# Altium schematic sheet GPS.SchDoc
size A3
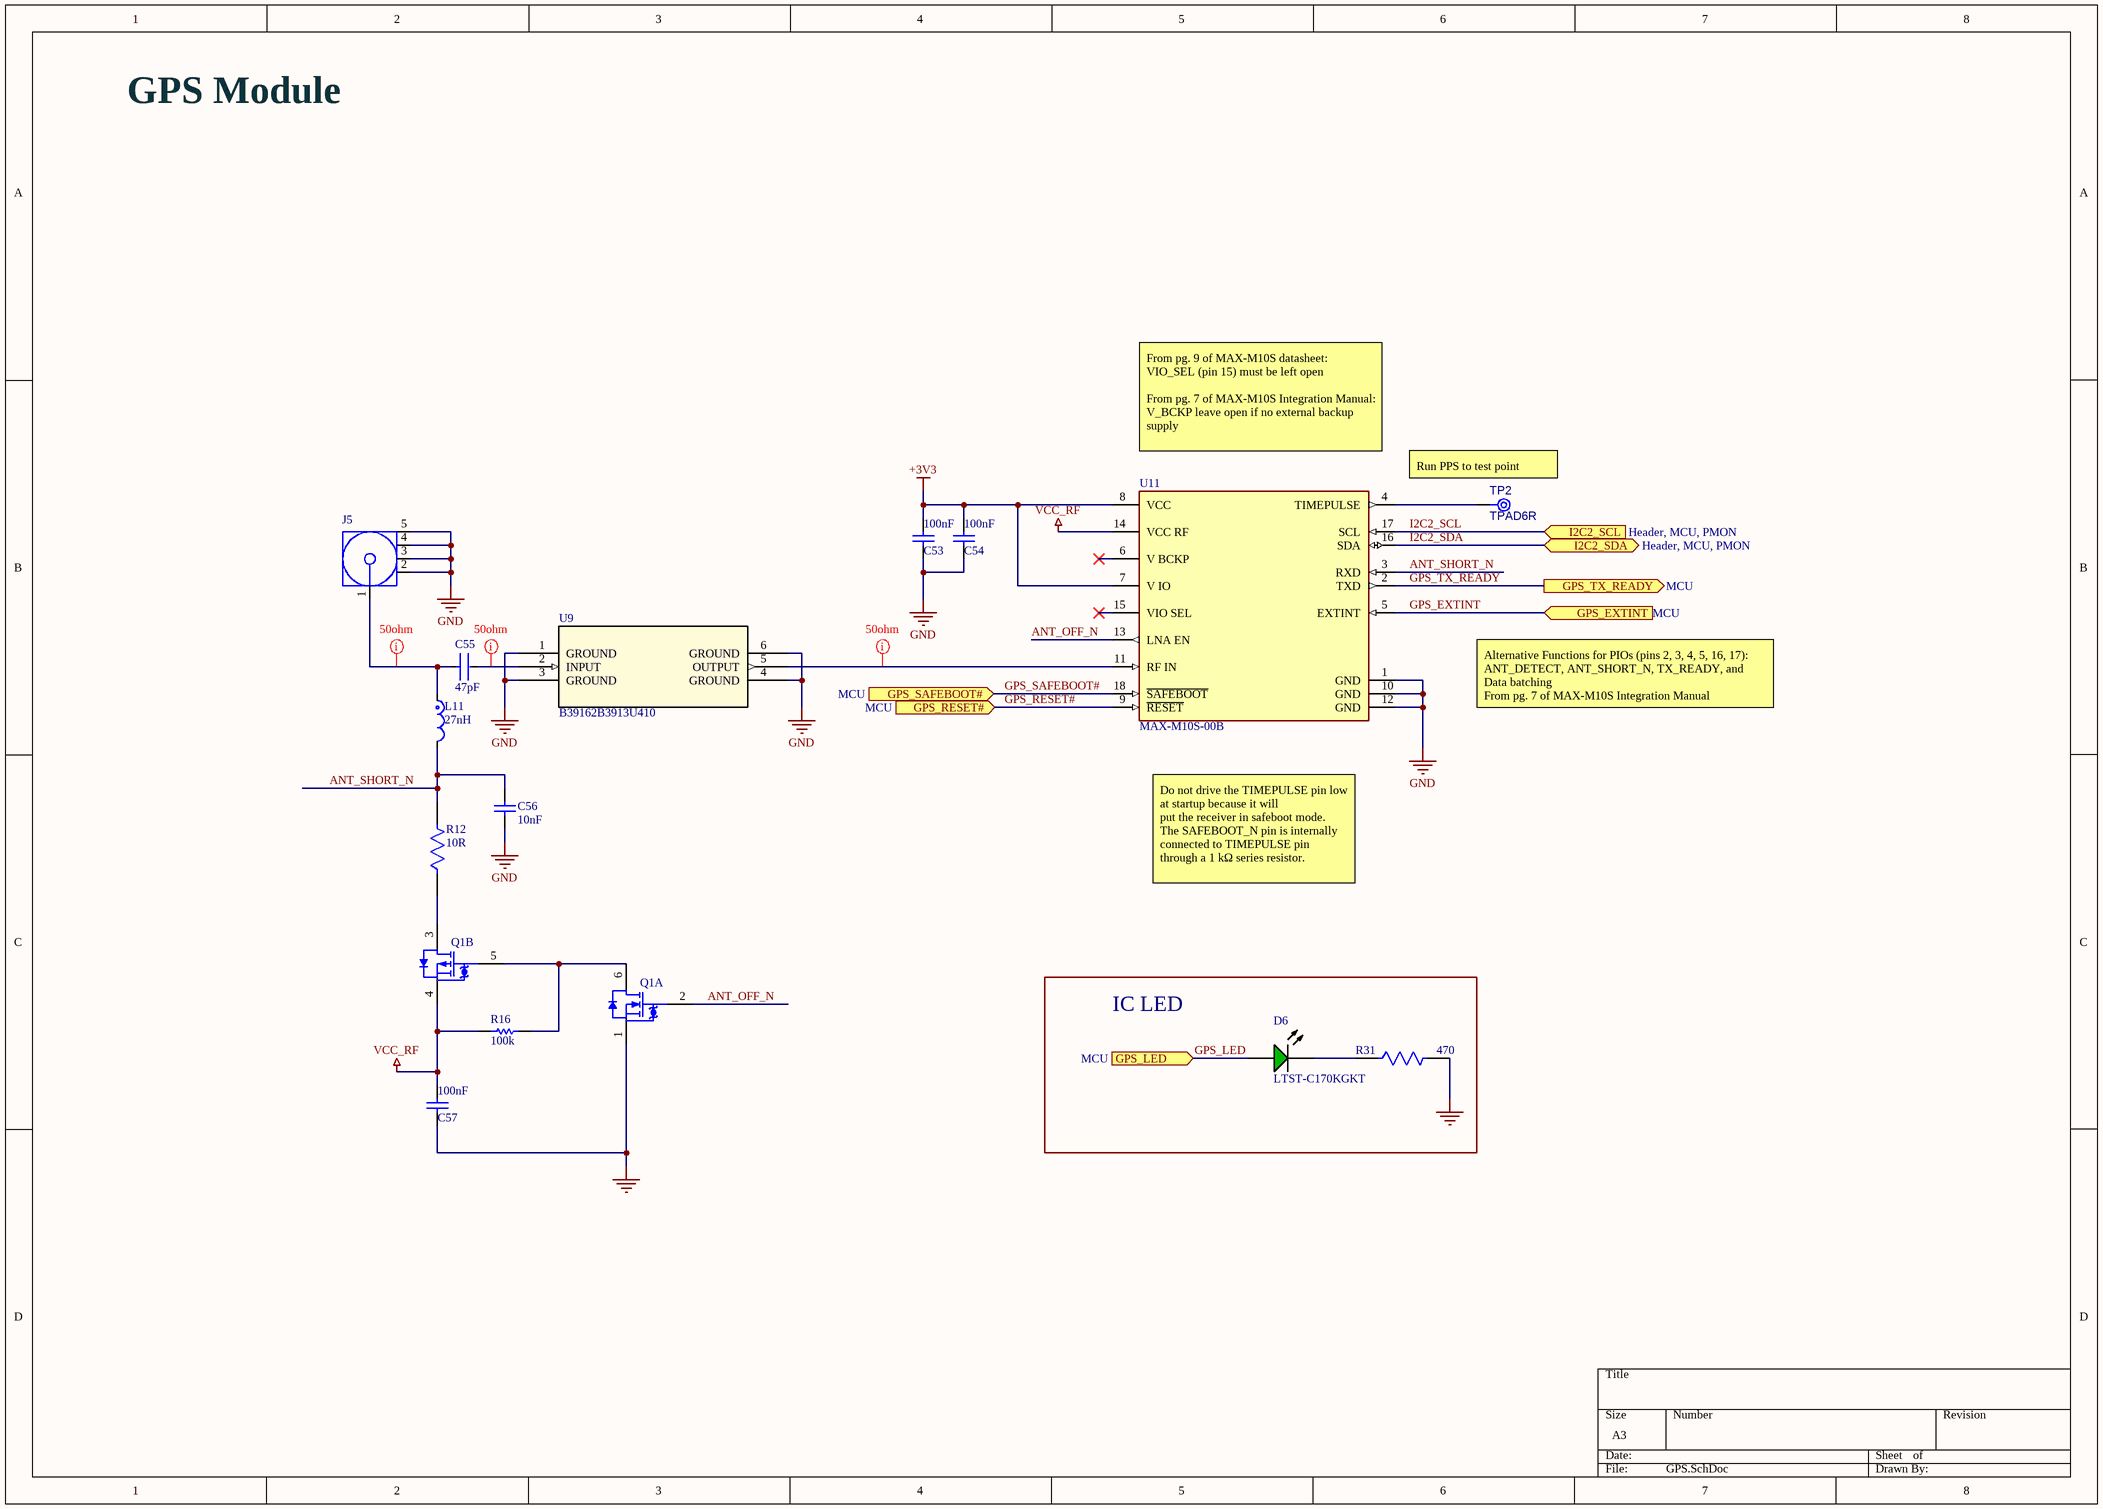
[diagram p0: GPS.SchDoc]

## Parts
C53  100nF  [CAPC1005X55X25ML05T10]
C54  100nF  [CAPC1005X55X25ML05T10]
C55  47pF  [FP-C0402-BB-MFG]
C56  10nF  [CAPC1005X55X25LL05T10]
C57  100nF  [CAPC1005X55X25ML05T10]
D6  LTST-C170KGKT  [LTST-LTST-C170KGKT-2_V]
J5  142-0701-801  [CINC-142-0701-801_V]  (value not drawn)
L11  27nH  [FP-LQG15HH_02-IPC_C]
Q1  NTZD3155CT1G  [ONSC-SOT-563-6-463A-01_V]  (value not drawn)  (parts A,B of 2)
R12  10R  [FP-ESR03-MFG]
R16  100k  [RESC1005X40X25ML10T10]
R31  470  [FP-CPF0603-MFG]
TP2  TPAD6R  [TP06R]  (no BOM)
U9  B39162B3913U410  [B39162B3913U410_QUA]
U11  MAX-M10S-00B  [FP-MAX-M10S-00B-MFG]

## Blocks framed on the sheet
IC LED: D6 R31

## Ports
GPS_EXTINT (in, see MCU), GPS_LED (in, see MCU), GPS_RESET# (in, see MCU), GPS_SAFEBOOT# (in, see MCU), GPS_TX_READY (out, see MCU), I2C2_SCL (in, see Header, MCU, PMON), I2C2_SDA (bidir, see Header, MCU, PMON)

## Nets
+3V3: C53.1 C54.1 U11.7(V_IO) U11.8(VCC)
GND: C53.2 C54.2 C56.1 C57.2 J5.2 J5.3 J5.4 J5.5 Q1.1(S1) R31.2 U9.1(GROUND) U9.3(GROUND) U9.4(GROUND) U9.6(GROUND) U11.1(GND) U11.10(GND) U11.12(GND)
VCC_RF: C57.1 Q1.4(S2) R16.1 U11.14(VCC_RF)
ANT_OFF_N: Q1.2(G1) U11.13(LNA_EN)
ANT_SHORT_N: C56.2 L11.2 R12.2 U11.3(RXD)
GPS_EXTINT: U11.5(EXTINT) ; port GPS_EXTINT
GPS_LED: D6.2(A) ; port GPS_LED
GPS_RESET#: U11.9(~{RESET}) ; port GPS_RESET#
GPS_SAFEBOOT#: U11.18(~{SAFEBOOT}) ; port GPS_SAFEBOOT#
GPS_TX_READY: U11.2(TXD) ; port GPS_TX_READY
I2C2_SCL: U11.17(SCL) ; port I2C2_SCL
I2C2_SDA: U11.16(SDA) ; port I2C2_SDA
NetC55_1: C55.1 J5.1 L11.1
NetC55_2: C55.2 U9.2(INPUT)
NetD6_1: D6.1(K) R31.1
NetQ1_3: Q1.3(D2) R12.1
NetQ1_5: Q1.5(G2) Q1.6(D1) R16.2
NetTP2_1: TP2.1(TP) U11.4(TIMEPULSE)
NetU9_5: U9.5(OUTPUT) U11.11(RF_IN)

Not connected (* = marked no-connect by the designer): U11 6(V_BCKP)* 15(VIO_SEL)*

## Layout directives
net class 50ohm: NetC55_1, NetC55_2, NetU9_5

## Notes on the sheet
- GPS Module
- From pg. 9 of MAX-M10S datasheet:
  VIO_SEL (pin 15) must be left open
  From pg. 7 of MAX-M10S Integration Manual:
  V_BCKP leave open if no external backup supply
- (near TP2) Run PPS to test point
- Alternative Functions for PIOs (pins 2, 3, 4, 5, 16, 17): ANT_DETECT, ANT_SHORT_N, TX_READY, and Data batching
  From pg. 7 of MAX-M10S Integration Manual
- Do not drive the TIMEPULSE pin low at startup because it will
  put the receiver in safeboot mode.
  The SAFEBOOT_N pin is internally
  connected to TIMEPULSE pin through a 1 kΩ series resistor.

## Library data of the parts
C53 C54 C57 = CMP-2008-04536-1: Part Number: GRM155R60J104KA01D; Manufacturer: Murata
C55 = CMP-03020-020906-1: C0402 47 pF C0G 5.00% 25 V; Manufacturer Part Number: C0402C470J3GACAUTO; Manufacturer: Kemet; Material: Ceramic; Temperature Coefficient: 15%; Tolerance: 0.05; Voltage Rating: 25 V; ComponentLink2URL: https://content.kemet.com/datasheets/KEM_C1002_X7R_SMD.pdf; Device Class L2: Capacitors; Octopart: https://octopart.com/c0402c470j3gacauto-kemet-91893770; Device Class L1: Passive Components; Value: 47 pF; Category: Cap; Lead Free: Yes; Height: 0.55mm; RoHS: TRUE; Temperature Range High: +125°C; Ipc Land Pattern Name: CAPC10050X50; Temperature: -55°C to +125°C; Package: C0402-BB; Capacitance: 47 pF; Temperature Range Low: -55°C; Temperature Characteristic: C0G; Automotive: No; ComponentLink2Description: Datasheet; Device Class L3: Ceramic Capacitors
C56 = CMP-2000-06332-1: Chip Capacitor, 10 nF, 16 V, 10%, -55 to 125 degC, 0402 (1005 Metric), RoHS, Tape and Reel; Manufacturer: Murata; Rated Voltage: 16V; Capacitance: 10000pF; Dielectric: X7R; Manufacturer URL: http://www.murata.com/; Package Description: 2-Pin Surface Mount Device, Body 1 x 0.5 mm; Case Size/Dimension: 0402; Tolerance (%): ±10%; Datasheet Version: 06/2016; Package Reference: 0402; Mounting Technology: SurfaceMount; Datasheet URL: http://psearch.en.murata.com/capacitor/product/GRM155R71C103KA01%23.pdf
D6 = CMP-2000-06620-1: Ultra Bright AlInGaP Chip LED, 75 mW, -55 to 85 degC, 2-Pin SMD (0805), RoHS, Tape and Reel; Manufacturer: Lite-On; Forward Current: 30mA; Power Dissipation Max: 75mW; Emitting Color: YellowGreen; Type: Uni-Color; Forward Voltage: 2.4V; Dominant Wave Length: 571nm; Test Current (It): 20mA; Product Length (mm): 2mm; Peak Wavelength: 574nm; Power Dissipation: 75W; Product Depth (mm): 1.25mm; DELETED: Compliant; High Brightness: Yes; Product Height (mm): 1.1mm; Luminous Intensity: 35mcd; Shape Type: Rectangular; Chip Material: AlGaInP; Viewing Angle: 130deg; Number of  Elements: 1; Reverse Voltage: 5V; Rad Hardened: No; Package Type: ChipLed; Manufacturer URL: http://www.us.liteon.com/; Mounting: SurfaceMount; Operating Temp Range: -55Cto85C; Datasheet URL: http://optoelectronics.liteon.com/upload/download/DS22-2000-073/S_110_LTST-C170KGKT.pdf; Packaging: TapeandReel; Pin Count: 2; Package Description: 2-Pin Surface Mounted Device, Body 2 x 1.25 mm; Mounting Technology: SurfaceMount; Package Reference: LTST-C170KGKT-2; Forward Current Max: 30mA; Datasheet Version: Rev. G, 06/2005; Lens Dimensions: 1.4x1.25x0.6mm; Operating Temperature Classification: Industrial; Lum Intensity: 35mcd; Main Category: ChipLED
J5 = CMP-2000-05490-1: SMA End Launch Jack Receptacle, 50 Ohm, 0 to 18 GHz, -65 to 165 degC, 5-Pin SMD, RoHS, Bulk; Manufacturer: EmersonConnectivitySolutions; Connector Type: JackPCB; Gender: Jack(Female); Impedance: 50Ohms; Brand: Johnson/EmersonConnectivitySolutions; Body Material: Brass; Body Style: Straight; Maximum Frequency: 18GHz; Factory Pack Quantity: 5; Datasheet URL: https://belfuse.com/resources/Johnson/productinformation/pi-142-0701-801.pdf; Datasheet Version: 12/2014; Operating Temperature Range: -65Cto+165C; Mounting Technology: SurfaceMount; RF Series: SMA; Package Reference: 142-0701-801; Product Category: RFConnectors/CoaxialConnectors; Termination Style: Solder; RoHS: Details; Package URL: https://belfuse.com/resources/Johnson/drawings/dr-1420701801.pdf; Series: SMA; Package Description: 5-Pin Surface Mount Device, Body 14.275 x 9.525 mm; Manufacturer URL: http://www.cinch.com/; Contact Plating: Gold; Product: Connectors; Orientation: Straight
L11 = CMP-2000-06578-2: Multilayer type RF Inductor 27nH ±5% 0.46Ω 350mA 0402; DC Current: 300mA; Core Material: Air; Self Resonant Frequency: 1.7GHz; Q Factor: 8; DC Resistance (DCR): 460mR; Shielding: Unshielded; Test Frequency: 100MHz; Inductance: 27nH; Width: 0.02inch; Length: 1mm; Height - Seated (Max): 0.022inch; Military Standard: Not; Case Code (Imperial): 0402; Tolerance: 5%; Depth: 0.55mm; Current Rating: 300mA; Inductance Tolerance: 5%; Lead Free: Lead Free; Height: 0.5mm; Max DC Current: 300mA; REACH SVHC: No SVHC; Package Quantity: 10000; Mount: Surface Mount; Termination: SMD/SMT; Case Code (Metric): 1005; Case/Package: 0402; Max Operating Temperature: 125°C; Packaging: Tape and Reel; Min Operating Temperature: -55°C
Q1 = CMP-1058-00825-1: Small Signal MOSFET, Complementary 20 V, 540 mA / -430 mA, with ESD Protection, 6-Pin SOT-563, Pb-Free, Tape and Reel; Manufacturer: On Semiconductor; V(BR)DSS Min (V): 20; VGS Max (V): 6; VGS(th) Max (V): 1; Crss Typ (pF): 10; Configuration: Dual; Package Type: SOT-563; Mounting Technology: Surface Mount; RoHS: Pb-Free; ComponentLink3Description: Package Specification; ComponentLink1Description: Manufacturer URL; DatasheetVersion: Rev. 3; PackageVersion: Rev. F, 04/2005; ComponentLink2URL: http://www.onsemi.com/pub_link/Collateral/NTZD3155C-D.PDF; Channel Polarity: Complementary; PackageReference: SOT-563-6-463A-01; ComponentLink2Description: Datasheet; PartNumber: NTZD3155CT1G; PackageDescription: 6-Pin Small Outline Transistor, Body 1.6 x 1.2 mm, Pitch 0.5 mm; Packing: Tape and Reel; ComponentLink3URL: http://www.onsemi.cn/pub_link/Collateral/463A-01.PDF; ComponentLink1URL: http://www.onsemi.com/
R12 = CMP-08839-028230-1: 10Ω ±5% 0.25W 0603 Anti-Surge Chip Resistor AEC-Q200; Max Power Dissipation: 250mW; Temperature Coefficient: 200ppm/°C; Features: Automotive AEC-Q200; Packaging: Tape and Reel; Series: ESR; Tolerance: 5%; Min Operating Temperature: -55°C; Case Code (Imperial): 0603; Resistance: 10R; RoHS Compliant: Yes; Resistor Type: Thick Film; Case/Package: 0603; Max Operating Temperature: 155°C; Number of Terminations: 2; Case Code (Metric): 1608
R16 = CMP-2002-03715-1: Part Number: RK73B1ETTP104J; Manufacturer: KOA Speer
R31 = CMP-03211-004765-1: RES SMD 470Ω 0.1% 1/16W 0603 / CPF0603B470RE; Manufacturer: TE Connectivity; Temperature Coefficient: 25ppm/°C; Voltage Rating: 50V; Power Rating: 0.063W; Value: 470Ω; Device Class L3: Chip SMD Resistors; RoHS: TRUE; Category: Res; Device Class L2: Resistors; Series: CPF; Height: 0.55mm; Temperature: -55°C to +155°C; Temperature Range High: +155°C; Automotive: No; octopart_url: https://octopart.com/cpf0603b470re-te+connectivity-23376607; packaging: 5k Reel; ComponentLink2Description: Datasheet; Temperature Range Low: -55°C; Device Class L1: Passive Components; Ipc Land Pattern Name: RESC15580X45; Package: CPF0603; Composition: Thin Film; Manufacturer Part Number: CPF0603B470RE; Resistance: 470Ω; Octopart: https://octopart.com/cpf0603b470re-te+connectivity-23376607; Lead Free: Yes; ComponentLink2URL: https://www.te.com/commerce/DocumentDelivery/DDEController?Action=showdoc&DocId=Data+Sheet%7F1773200%7FM%7Fpdf%7FEnglish%7FENG_DS_1773200_M.pdf%7F3-1676481-2; Tolerance: 0.1%
TP2 = CMP-00028-00002-2: 0.6mm round; Pins: 1
U9 = CMP-026-000001-1: No Description Available; Mfr_Name: Qualcomm; ComponentLink1URL: *; Type: Type; Design Item ID: B39162B3913U410; ComponentLink1Description: New link; RefDes: RefDes; Source: B39162B3913U410.SchLib
U11 = CMP-207130-000026-1: GNSS LCC RX, ROM, TCXO, LNA, SAW